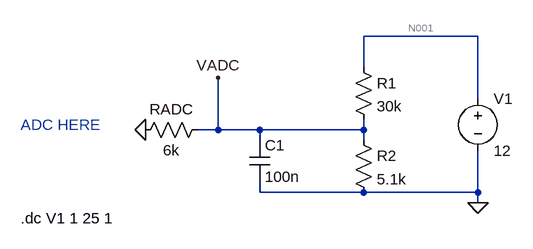
[diagram p0: schematic Voltage Divider.asc]
Voltage Divider.asc, the LTspice schematic file:
Version 4
SHEET 1 880 680
WIRE 256 32 80 32
WIRE 80 80 80 32
WIRE 256 128 256 32
WIRE -144 176 -144 96
WIRE -144 176 -176 176
WIRE -80 176 -144 176
WIRE 80 176 80 160
WIRE 80 176 -80 176
WIRE -80 192 -80 176
WIRE 80 192 80 176
WIRE -80 272 -80 256
WIRE 80 272 -80 272
WIRE 256 272 256 208
WIRE 256 272 80 272
WIRE 256 288 256 272
FLAG 256 288 0
FLAG -256 176 0
FLAG -144 96 VADC
SYMBOL res 64 64 R0
SYMATTR InstName R1
SYMATTR Value 30k
SYMBOL res 64 176 R0
SYMATTR InstName R2
SYMATTR Value 5.1k
SYMBOL cap -96 192 R0
SYMATTR InstName C1
SYMATTR Value 100n
SYMBOL res -160 160 R90
WINDOW 0 0 56 VBottom 2
WINDOW 3 32 56 VTop 2
SYMATTR InstName RADC
SYMATTR Value 6k
SYMBOL voltage 256 112 R0
SYMATTR InstName V1
SYMATTR Value 12
TEXT -448 168 Left 2 ;ADC HERE
TEXT -448 312 Left 2 !.dc V1 1 25 1

The netlist it stands for:
* Voltage Divider.asc
R1 N001 VADC 30k
R2 VADC 0 5.1k
C1 VADC 0 100n
RADC VADC 0 6k
V1 N001 0 12
* ADC HERE
.dc V1 1 25 1
.backanno
.end

* Results of the author's LTspice run, read from the files saved beside the schematic
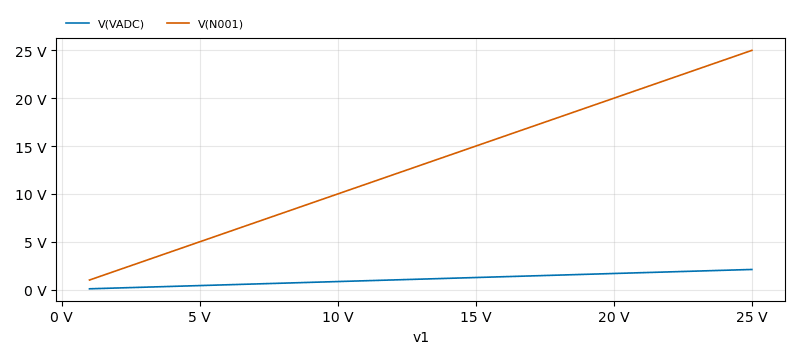
[diagram p1: DC transfer characteristic of Voltage Divider.asc, plotted from the saved traces]
* DC transfer characteristic, 1 run:
*   V(VADC): 84.16 mV at v1=1 V, 2.104 V at v1=25 V, min 84.16 mV, max 2.104 V
*   V(N001): 1 V at v1=1 V, 25 V at v1=25 V, min 1 V, max 25 V